# EAGLE design working (EAGLE 9.5.0)
AUTHOR: BRYAN; COMPANY: ADAFRUIT INDUSTRIES; REV: A
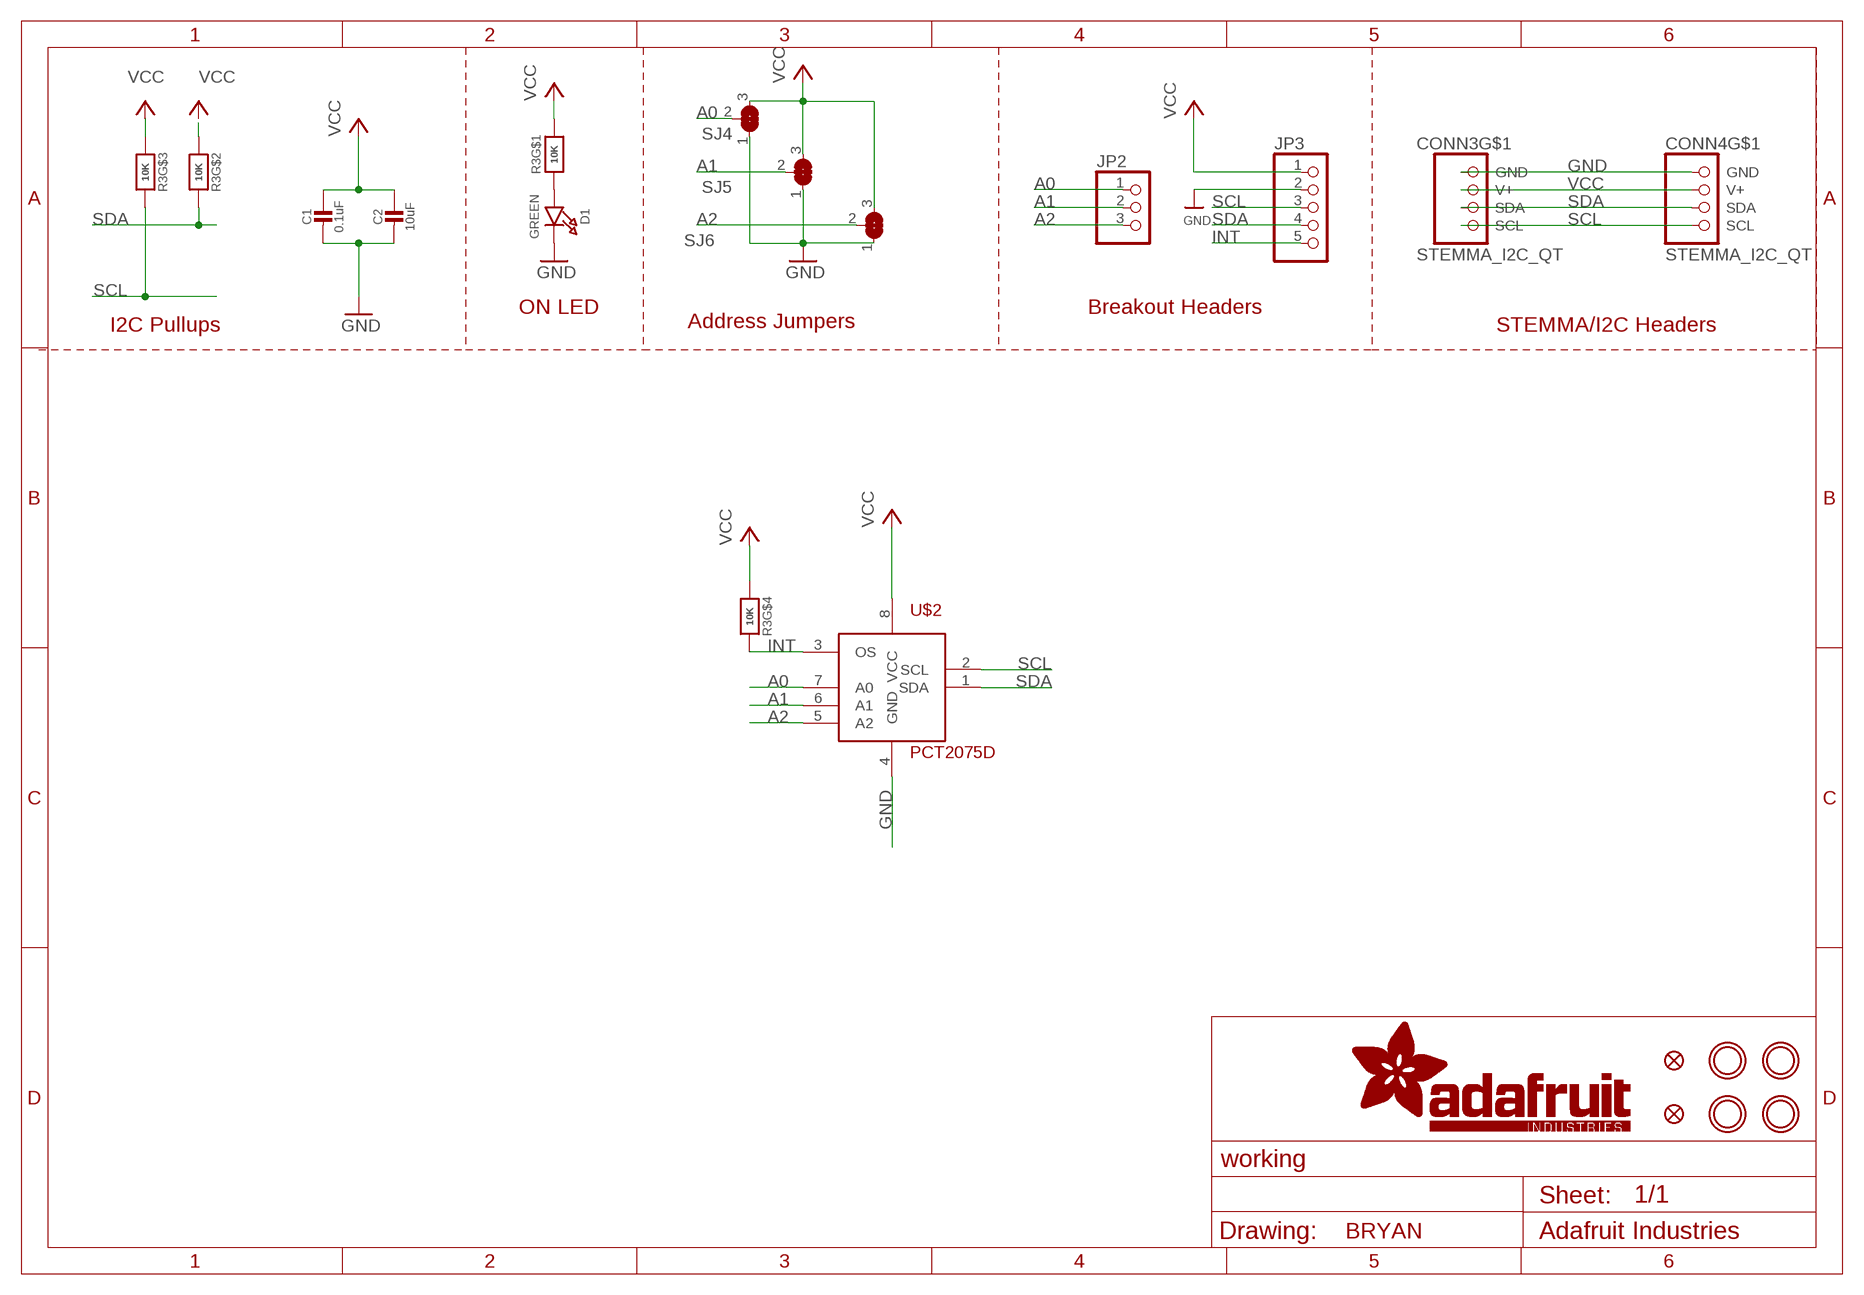
[diagram p0: schematic, sheet 1]

## Parts
C1  0.1uF  CAP_CERAMIC0603_NO  [0603-NO]
C2  10uF  CAP_CERAMIC0805-NOOUTLINE  [0805-NO]
CONN3  STEMMA_I2C_QT  [JST_SH4]
CONN4  STEMMA_I2C_QT  [JST_SH4]
D1  GREEN  LED0603_NOOUTLINE  [CHIPLED_0603_NOOUTLINE]
FID3  FIDUCIAL_1MM  [FIDUCIAL_1MM]
FID4  FIDUCIAL_1MM  [FIDUCIAL_1MM]
JP2  HEADER-1X3ROUND  [1X03_ROUND]
JP3  HEADER-1X5ROUND  [1X05_ROUND]
R3  10K  RESISTOR_4PACK  [RESPACK_4X0603]
SJ4  SOLDERJUMPER_2WAY  [SOLDERJUMPER_2WAY_OPEN_NOPASTE]
SJ5  SOLDERJUMPER_2WAY  [SOLDERJUMPER_2WAY_OPEN_NOPASTE]
SJ6  SOLDERJUMPER_2WAY  [SOLDERJUMPER_2WAY_OPEN_NOPASTE]
U$1  MOUNTINGHOLE2.5  [MOUNTINGHOLE_2.5_PLATED]
U$2  PCT2075D  [SOIC8_150MIL]
U$17  MOUNTINGHOLE2.5  [MOUNTINGHOLE_2.5_PLATED]
U$19  MOUNTINGHOLE2.5  [MOUNTINGHOLE_2.5_PLATED]
U$21  MOUNTINGHOLE2.5  [MOUNTINGHOLE_2.5_PLATED]

## Nets
A0: JP2.1 SJ4.2 U$2.7(A0)
A1: JP2.2 SJ5.2 U$2.6(A1)
A2: JP2.3 SJ6.2 U$2.5(A2)
GND [highpower]: C1.2 C2.2 CONN3.1(GND) CONN4.1(GND) D1.C JP3.2 SJ4.1 SJ5.1 SJ6.1 U$2.4(GND)
INT: JP3.5 R3.5 U$2.3(OS)
N$1: D1.A R3.1
SCL: CONN3.4(SCL) CONN4.4(SCL) JP3.3 R3.6 U$2.2(SCL)
SDA: CONN3.3(SDA) CONN4.3(SDA) JP3.4 R3.7 U$2.1(SDA)
VCC [lowpower]: C1.1 C2.1 CONN3.2(V+) CONN4.2(V+) JP3.1 R3.2 R3.3 R3.4 R3.8 SJ4.3 SJ5.3 SJ6.3 U$2.8(VCC)
Unconnected: CONN3.MT1(MT) CONN3.MT2(MT) CONN4.MT1(MT) CONN4.MT2(MT)

## Notes on the sheet
- ON LED | Breakout Headers
- I2C Pullups | Address Jumpers | STEMMA/I2C Headers

## Library data of the parts
C1 C2 = microbuilder:CAP_CERAMIC: Ceramic Capacitors For new designs, use the packages preceded by an '_' character since they are more reliable: The following footprints should be used on most boards: _0402 - Standard footprint for regular board layouts _0603 - Standard footprint for regular board layouts _0805 - Standard footprint for regular board layouts _1206 - Standard footprint for regular board layouts For extremely tight-pitch boards where space is at a premium, the following 'micro-pitch' footprints can be used (smaller pads, no silkscreen outline, etc.): _0402MP - Micro-pitch footprint for very dense/compact boards _0603MP - Micro-pitch footprint for very dense/compact boards _0805MP - Micro-pitch footprint for very dense/compact boards _1206MP - Micro-pitch footprint for very dense/compact boards
CONN3 CONN4 = microbuilder:STEMMA_I2C
D1 = microbuilder:LED: LED 0603 - 0603 Surface Mount Package 2mA: Green LED - Low Power (3.9mcd, 2ma, 1.7Vf) - Digikey: 475-2709-2-ND Orange LED - Low Power (9.8mcd, 2ma, 1.8Vf) - Digikey: 475-1194-2-ND Red LED - Low Power (5mcd, 2ma, 1.8Vf) - Digikey: 475-1195-2-ND Yellow LED - Low Power (7mcd, 2ma, 1.8Vf) - Digikey: 475-1196-2-ND 5mA: Blue LED - Low Power (17mcd, 5ma, 2.9Vf) - Digikey: LNJ937W8CRACT-ND 0805 - 0805 Surface Mount Package 2mA: Red LED (8.8mcd, 2mA, 1.8Vf, Clear) - Low Power [Digikey: 475-2510-1-ND] Green LED (5mcd, 2mA, 1.8Vf, Clear) - Low Power [Digikey: 475-2730-1-ND] Yellow LED (11.3mcd, 2mA, 1.8Vf, Clear) - Low Power [Digikey: 475-2555-1-ND] 20mA: Red LED (104mcd, 20mA, Diffused) - LS R976 [Digikey: 475-1278-6-ND] Red LED (12mcd, 20mA, 2.0Vf, Clear) - APT2012EC [Digikey: 754-1128-1-ND] Green LED (15mcd, 20mA, 2.2Vf, Clear) - APT2012GC [Digikey: 754-1131-1-ND] Orange LED (160mcd, 20mA, 2.1Vf, Clear) - APT2012SECK [Digikey: 754-1130-1-ND] 1206 - 1206 Surface Mount Package Green LED (26mcd, 20mA, Diffused) - LG N971 [Digikey: 475-1407-6-ND] Red LED (15mcd, 20mA, Diffused) - LH N974 [Digikey: 475-1416-6-ND] Cree - Cree High-Power Surface Mount LEDs XPEBWT-L1-0000-00D50 - White 111lm 350mA 2.9Vf 6200K 110° XTEAWT-00-0000-00000LEE3 - White 114lm 350mA 2.85Vf 5000K 115° Everlight - Everlight 45-21 Series Surface Mount LEDs 45-21/QK2C-B2832AC2CB2/2T - Warm White 2000mcd 20mA 3.25Vf 3050K 120° 45-21/LK2C-B38452C4CB2/2T - Nuetral White 2000mcd 20mA 3.25Vf 4150K 120° 45-21/LK2C-B50634C6CB2/2T - Cold White 2200mcd 20mA 3.25Vf 5650K 120° PLCC2 Reverse Mount LS T77K-J1L2-1-0-2-R18-Z - Red 11.25mcd 2mA 1.8Vf 630nm 120° LO T77K-L1M2-24-Z - Orange 19.6mcd 2mA 1.8Vf 606nm 120° LY T77K-K2M1-26-Z - Yellow 15.7mcd 2mA 1.8Vf 587nm 120°
FID3 FID4 = microbuilder:FIDUCIAL: Fiducial Alignment Points Various fiducial points for machine vision alignment.; BOM: EXCLUDE
JP2 = microbuilder:HEADER-1X3: PIN HEADER
JP3 = microbuilder:HEADER-1X5: PIN HEADER
R3 = microbuilder:RESISTOR_4PACK: Resistor Packs (4 resistors) 4 x 0603 10K 1/16W - Digikey: YC164J-10KCT-ND
SJ4-SJ6 = microbuilder:SOLDERJUMPER_2WAY: 2-Way Solder Jumper
U$1 U$17 U$19 U$21 = microbuilder:MOUNTINGHOLE: Mounting Hole For #2 screws (0.086"/2.18mm width, 0.094"/2.4mm hole) use 2.5mm; BOM: EXCLUDE
U$2 = microbuilder:PCT2075D

## Net classes
1 highpower: width 0.406 mm, drill 0.483 mm
2 lowpower: width 0.305 mm, drill 0.483 mm

## Board
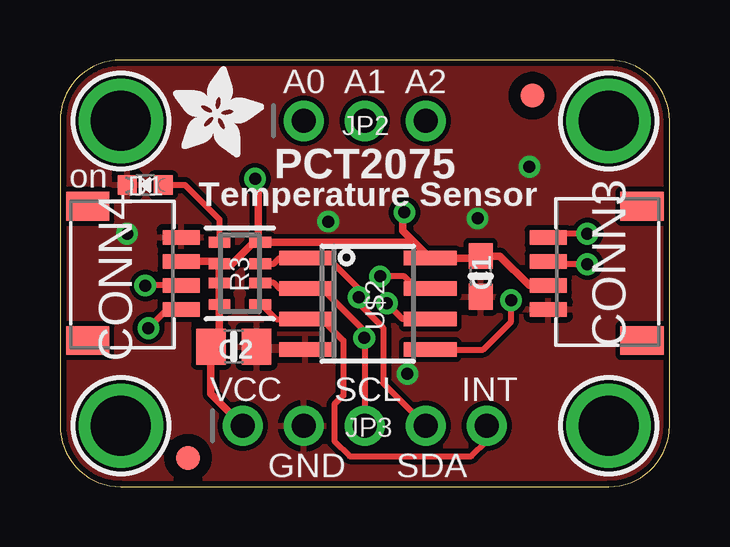
[diagram p1: board, top side]
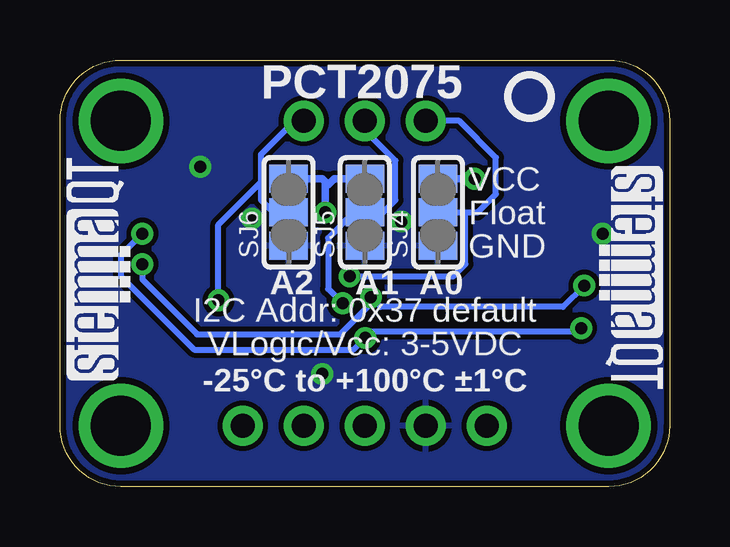
[diagram p2: board, bottom side, seen from below]

Size 25.4 x 17.78 mm. Coordinates in mm from the lower left corner, seen from the top.
Outline: 0,15.24 0,2.54 arc90 2.54,0 22.86,0 arc90 25.4,2.54 25.4,15.24 arc90 22.86,17.78 2.54,17.78 arc90 0,15.24
Copper layers (1*16): Top 0.035mm / dielectric 1.5mm / Bottom 0.035mm
Design rules "adafruit *": minimum track width 8mil, minimum drill 15.5mil, track to track 8mil, track to pad 8mil, pad to pad 8mil, via to via 8mil, smd to smd 8mil, copper to edge 10mil, drill to drill 8mil, minimum pad ring 10mil, minimum via ring 8mil, stop-mask expansion 2mil, vias tented up to drill 20mil, thermal gap 10mil

### Footprints (pad centres in the part's own frame; a part is rotated, then mirrored left to right if it is on the bottom)
0603-NO = smd 1.075 x 1: 1 -0.85,0; 2 0.85,0
0805-NO = smd 1.24 x 1.5: 1 -0.95,0; 2 0.95,0
JST_SH4 = smd 0.6 x 1.55: 1 -1.5,2.514; 2 -0.5,2.514; 3 0.5,2.514; 4 1.5,2.514 | smd 1.2 x 1.8: MT1 -2.8,-1.386; MT2 2.8,-1.386
CHIPLED_0603_NOOUTLINE = smd 0.8 x 0.8: A 0,-0.75; C 0,0.75
FIDUCIAL_1MM = smd 1 x 1: 1 0,0
1X03_ROUND = drill 1 pad 1.676: 1 -2.54,0; 2 0,0; 3 2.54,0
1X05_ROUND = drill 1 pad 1.676: 1 -5.08,0; 2 -2.54,0; 3 0,0; 4 2.54,0; 5 5.08,0
RESPACK_4X0603 = smd 0.45 x 0.9: 1 -1.3,-0.85; 2 -0.4,-0.85; 3 0.4,-0.85; 4 1.3,-0.85; 5 1.3,0.85; 6 0.4,0.85; 7 -0.4,0.85; 8 -1.3,0.85
SOLDERJUMPER_2WAY_OPEN_NOPASTE = smd 1.168 x 1.6: 1 -1.397,0; 2 0,0; 3 1.397,0
MOUNTINGHOLE_2.5_PLATED = drill 2.5 pad 3.2: P$1 0,0
SOIC8_150MIL = smd 0.6 x 2.2: 1 -1.905,-2.6; 2 -0.635,-2.6; 3 0.635,-2.6; 4 1.905,-2.6; 5 1.905,2.6; 6 0.635,2.6; 7 -0.635,2.6; 8 -1.905,2.6

### Placement (x,y rotation side)
C1  17.53,8.76 270 top
C2  7.24,5.84 0 top
CONN3  22.86,8.89 90 top
CONN4  2.54,8.89 270 top
D1  3.56,12.57 90 top
FID3  5.33,1.21 0 top
FID4  19.68,16.29 0 top
JP2  12.7,15.24 0 top
JP3  12.7,2.54 0 top
R3  7.49,8.89 270 top
SJ4  9.65,11.43 90 bottom
SJ5  12.7,11.43 90 bottom
SJ6  15.88,11.43 90 bottom
U$1  2.54,15.24 0 top
U$2  12.83,7.62 270 top
U$17  22.86,15.24 0 top
U$19  2.54,2.54 0 top
U$21  22.86,2.54 0 top
U$22  [ADAFRUIT_3.5MM]  4.7,13.72 0 top
U$25  [PCBFEAT-REV-040]  5.84,16.26 0 bottom
U$30  [STEMMAQT]  22.48,4.45 90 bottom
U$31  [STEMMAQT]  2.92,13.34 270 bottom

### Tracks (layer width: path | path; a pad name or v marks a point on that pad's centre or on a via)
A0  (via drill 0.5)
  Top 0.254: U$2.7 14.86,8.26 14.35,8.76 v13.34,8.76
  Bottom 0.254: SJ4.2 8.51,11.43 | 8.51,11.43 8,11.43 7.24,12.19 7.24,13.72 8.76,15.24 JP2.1 | v13.34,8.76 9.02,8.76 8.51,9.27 8.51,11.43
A1  (via drill 0.5)
  Top 0.254: U$2.6 14.28,6.99 v13.62,7.64
  Bottom 0.254: JP2.2 12.7,14.86 11.43,13.59 11.43,11.94 11.94,11.43 SJ5.2 13.15,11.43 14.22,10.36 14.22,8.24 v13.62,7.64
A2  (via drill 0.5)
  Top 0.254: U$2.5 17.63,5.71 18.8,6.88 v18.8,7.77
  Bottom 0.254: SJ6.2 16.51,11.43 17.02,11.94 17.02,12.7 | 17.02,12.7 17.02,13.84 15.62,15.24 JP2.3 | v18.8,7.77 18.8,10.92 17.02,12.7
GND  (via drill 0.5)
  other vias: 14.48,4.7 2.79,10.54 19.56,13.34 11.18,11.05 17.4,11.18
  pour Top: 0,17.78 25.4,17.78 25.4,0 0,0
  pour Bottom: 0,17.78 25.4,17.78 25.4,0 0,0
INT
  Top 0.254: R3.5 8.41,7.59 9.02,6.99 U$2.3 10.91,6.99 11.81,6.09 11.81,3.81 11.43,3.43 11.43,1.91 12.06,1.27 17.14,1.27 17.78,1.91 JP3.5
N$1
  Top 0.254: D1.A 5.21,12.57 6.64,11.14 R3.1
SCL  (via drill 0.5)
  Top 0.254: R3.6 8.91,8.49 9.14,8.26 U$2.2 10.92,8.26 12.68,6.5 v12.68,6.2 12.7,6.18 JP3.3 | CONN4.4 4.93,7.26 4.34,7.26 v3.68,6.6 | v21.97,10.54 20.5,10.54 CONN3.4
  Bottom 0.254: v3.68,6.6 3.81,6.48 12.4,6.48 v12.68,6.2 13.16,5.71 19.81,5.71 22.86,8.76 22.86,9.65 v21.97,10.54
SDA  (via drill 0.5)
  Top 0.254: R3.7 8.36,9.27 8.89,9.27 9.14,9.53 U$2.1 11.18,9.53 12.45,8.26 v12.45,7.89 12.45,7.64 13.46,6.62 13.46,4.32 JP3.4 | CONN4.3 v3.56,8.39 v3.56,8.38 | v21.97,9.27 20.46,9.27 CONN3.3
  Bottom 0.254: v21.97,9.27 21.97,8.64 19.68,6.35 13.72,6.35 12.45,7.62 v12.45,7.89 12.04,7.49 4.45,7.49 v3.56,8.38
VCC  (via drill 0.5)
  Top 0.305: CONN4.2 6.54,9.39 R3.2 | R3.2 R3.3 R3.4 6.64,6.2 C2.1 6.29,3.87 JP3.1 | 8.26,10.19 R3.8 14.76,10.19 U$2.8 | 8.26,10.19 8.06,10.19 7.15,9.27 6.66,9.27 R3.2 | CONN3.2 19.55,8.39 18.33,9.61 C1.1 17.44,9.53 U$2.8 | U$2.8 14.28,10.67 14.28,11.36 v14.35,11.43 | v8.13,12.83 8.26,12.7 8.26,10.19
  Bottom 0.305: v14.35,11.43 14.35,12.7 | SJ4.3 v8.13,12.83 | SJ5.3 13.97,12.83 14.22,12.57 14.35,12.7 | 14.35,12.7 14.48,12.83 SJ6.3

### Text on the board
tPlace: A0 | A1 | A2 | PCT2075 | on | Temperature Sensor | VCC | SCL | INT | GND | SDA
bPlace: PCT2075 | VCC | Float | GND | A0 | A1 | A2 | I2C Addr: 0x37 default | VLogic/Vcc: 3-5VDC | -25°C to +100°C ±1°C